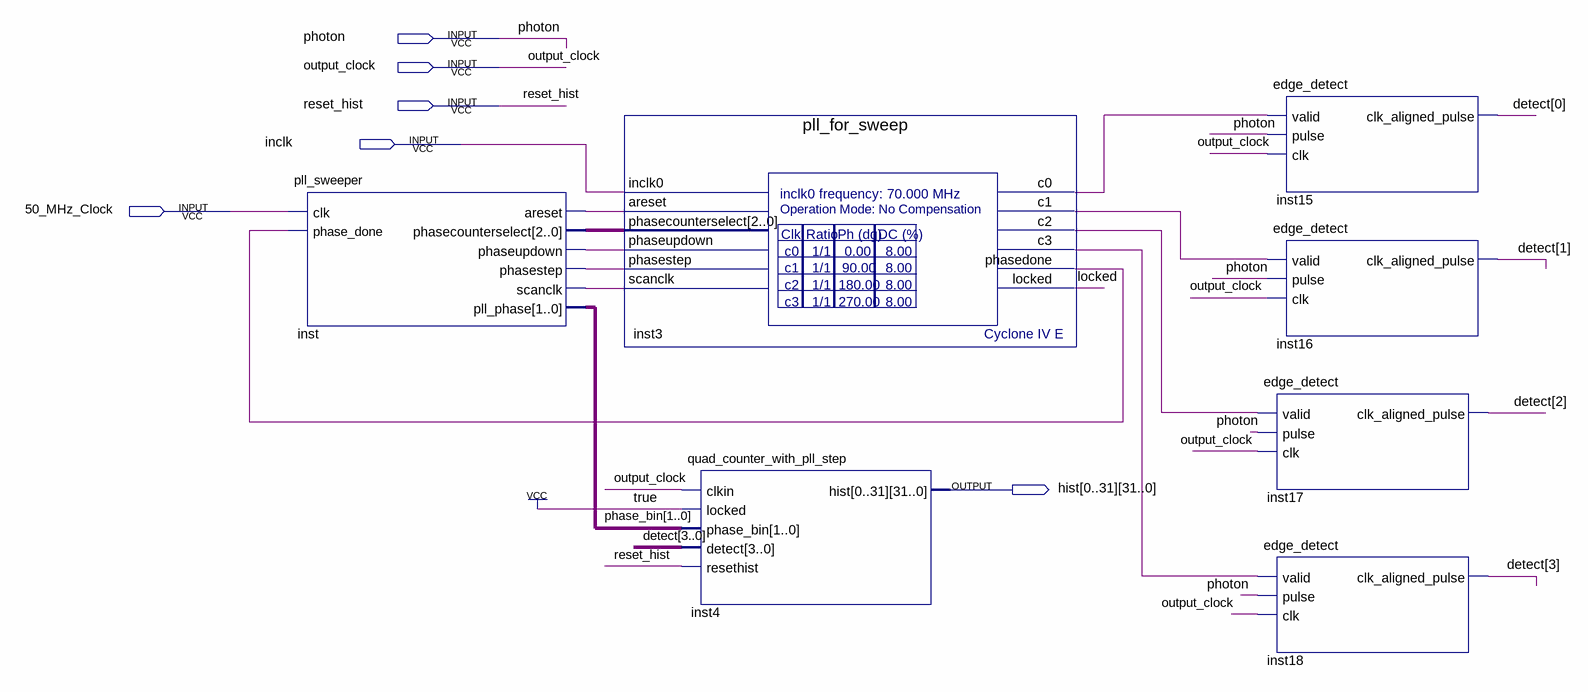
[diagram p0: schematic sheet]
// Quartus schematic sweeping_histogram.bdf as structural Verilog: 7 symbols, 6 pins
module sweeping_histogram (
  input  photon,
  input  output_clock,
  input  reset_hist,
  input  inclk,
  input  \50_MHz_Clock ,
  output [31:0] hist_0,
  output [31:0] hist_1,
  output [31:0] hist_2,
  output [31:0] hist_3,
  output [31:0] hist_4,
  output [31:0] hist_5,
  output [31:0] hist_6,
  output [31:0] hist_7,
  output [31:0] hist_8,
  output [31:0] hist_9,
  output [31:0] hist_10,
  output [31:0] hist_11,
  output [31:0] hist_12,
  output [31:0] hist_13,
  output [31:0] hist_14,
  output [31:0] hist_15,
  output [31:0] hist_16,
  output [31:0] hist_17,
  output [31:0] hist_18,
  output [31:0] hist_19,
  output [31:0] hist_20,
  output [31:0] hist_21,
  output [31:0] hist_22,
  output [31:0] hist_23,
  output [31:0] hist_24,
  output [31:0] hist_25,
  output [31:0] hist_26,
  output [31:0] hist_27,
  output [31:0] hist_28,
  output [31:0] hist_29,
  output [31:0] hist_30,
  output [31:0] hist_31
);

  wire inst3_c0, inst3_c1, inst3_c2, inst3_c3, inst3_phasedone, inst_areset, inst_phasestep,
       inst_phaseupdown, inst_scanclk, locked;
  wire [1:0] phase_bin;
  wire [2:0] inst_phasecounterselect;
  wire [3:0] detect;

  pll_sweeper inst (
    .clk(\50_MHz_Clock ), .phase_done(inst3_phasedone), .areset(inst_areset),
    .phasecounterselect(inst_phasecounterselect), .phaseupdown(inst_phaseupdown), .phasestep(inst_phasestep),
    .scanclk(inst_scanclk), .pll_phase(phase_bin));
  pll_for_sweep inst3 (
    .inclk0(inclk), .areset(inst_areset), .phasecounterselect(inst_phasecounterselect),
    .phaseupdown(inst_phaseupdown), .phasestep(inst_phasestep), .scanclk(inst_scanclk), .c0(inst3_c0),
    .c1(inst3_c1), .c2(inst3_c2), .c3(inst3_c3), .phasedone(inst3_phasedone), .locked(locked));
  quad_counter_with_pll_step inst4 (
    .clkin(output_clock), .locked(1'b1), .phase_bin(phase_bin), .detect(detect), .resethist(reset_hist),
    .hist({hist_0, hist_1, hist_2, hist_3, hist_4, hist_5, hist_6, hist_7, hist_8, hist_9, hist_10, hist_11, hist_12, hist_13, hist_14, hist_15, hist_16, hist_17, hist_18, hist_19, hist_20, hist_21, hist_22, hist_23, hist_24, hist_25, hist_26, hist_27, hist_28, hist_29, hist_30, hist_31}));
  edge_detect inst15 (.valid(inst3_c0), .pulse(photon), .clk(output_clock), .clk_aligned_pulse(detect[0]));
  edge_detect inst16 (.valid(inst3_c1), .pulse(photon), .clk(output_clock), .clk_aligned_pulse(detect[1]));
  edge_detect inst17 (.valid(inst3_c2), .pulse(photon), .clk(output_clock), .clk_aligned_pulse(detect[2]));
  edge_detect inst18 (.valid(inst3_c3), .pulse(photon), .clk(output_clock), .clk_aligned_pulse(detect[3]));
endmodule
